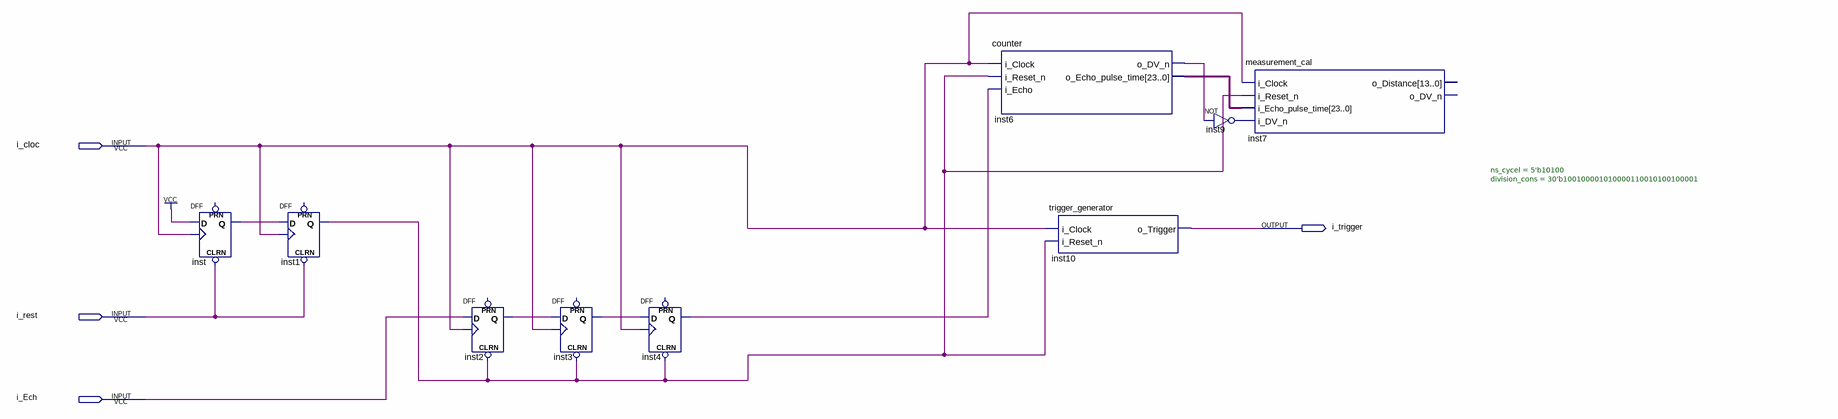
[diagram p0: schematic sheet]
// Quartus schematic q5.bdf as structural Verilog: 9 symbols, 4 pins
module q5 (
  input  i_cloc,
  input  i_rest,
  input  i_Ech,
  output i_trigger
);

  wire inst1_q, inst2_q, inst3_q, inst4_q, inst6_o_dv_n, inst9_out, inst_q;
  wire [23:0] inst6_o_echo_pulse_time;

  DFF inst (.CLRN(i_rest), .CLK(i_cloc), .D(1'b1), .Q(inst_q));  // open: PRN
  DFF inst1 (.CLRN(i_rest), .CLK(i_cloc), .D(inst_q), .Q(inst1_q));  // open: PRN
  DFF inst2 (.CLRN(inst1_q), .CLK(i_cloc), .D(i_Ech), .Q(inst2_q));  // open: PRN
  DFF inst3 (.CLRN(inst1_q), .CLK(i_cloc), .D(inst2_q), .Q(inst3_q));  // open: PRN
  DFF inst4 (.CLRN(inst1_q), .CLK(i_cloc), .D(inst3_q), .Q(inst4_q));  // open: PRN
  counter inst6 (
    .i_Clock(i_cloc), .i_Reset_n(inst1_q), .i_Echo(inst4_q), .o_DV_n(inst6_o_dv_n),
    .o_Echo_pulse_time(inst6_o_echo_pulse_time));
  trigger_generator inst10 (.i_Clock(i_cloc), .i_Reset_n(inst1_q), .o_Trigger(i_trigger));
  not inst9 (inst9_out, inst6_o_dv_n);
  measurement_cal #(.ns_cycel(5'b10100), .division_cons(30'b100100001010000110010100100001)) inst7 (
    .i_Clock(i_cloc), .i_Reset_n(inst1_q), .i_Echo_pulse_time(inst6_o_echo_pulse_time), .i_DV_n(inst9_out));  // open: o_Distance, o_DV_n
endmodule
